# Altium schematic sheet Power.SchDoc: Наименование
size 420 x 297 mm; ApprovedBy: Утвердил; CheckedBy: Проверил; Author: Разработал; CompanyName: ВлГУ; DrawnBy: Н.Контр; Engineer: Т.Контр; SheetNumber: 3; SheetTotal: 1; PageSetup: Record=PageOptions|CenterHorizontal=True|CenterVertical=True|PrintScale=0.94|XCorrection=1.00|YCorrection=1.00|PrintKind=1|BorderSize=5000000|LeftOffset=0|BottomOffset=0|Orientation=1|PaperLength=1000|PaperWidth=1000|Scale=100|PaperSource=7|PrintQuality=-4|MediaType=1|DitherType=10|PaperKind=A4|PrintScaleMode=1; HeadOfSector: Нач. сектора; MainDevice: Перв.примен.; Name: Наименование; DocumentName: Sheet1.SCHDOC
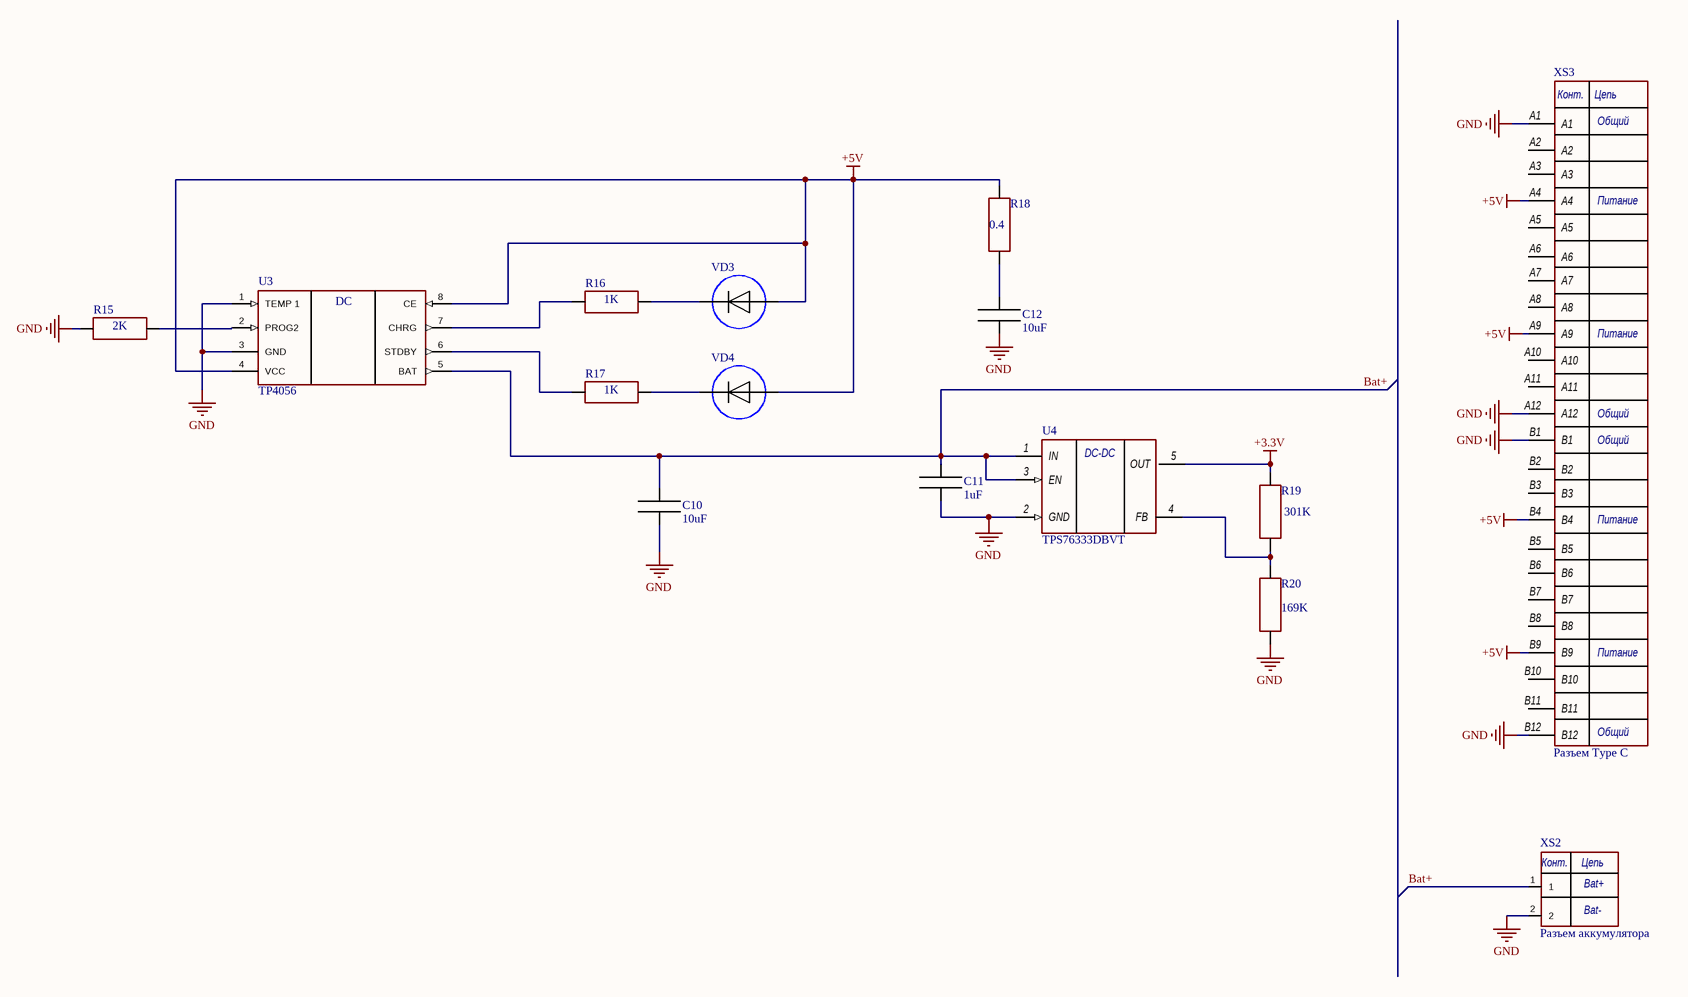
[diagram p0: Power.SchDoc]

## Parts
C10  10uF  [0402]
C11  1uF  [0402]
C12  10uF  [0402]
R15  2K  [0402]
R16  1K  [0402]
R17  1K  [0402]
R18  0.4  [0402]
R19  301K  [0402]
R20  169K  [0402]
U3  TP4056  [SOP-8]
U4  TPS76333DBVT  [SOT23-5]
VD3  Светодиод  [0402]  (value not drawn)
VD4  Светодиод  [0402]  (value not drawn)
XS2  Разъем аккумулятора  [PIN 2]
XS3  Разъем Type C  [USB Type C]

## Nets
+3.3V: R19.2 U4.5(OUT)
+5V: R18.2 U3.4(VCC) U3.8(CE) VD3.1 VD4.1 XS3.A4 XS3.A9 XS3.B4 XS3.B9
GND: C10.1 C11.1 C12.1 R15.1 R20.1 U3.1(TEMP_1) U3.3(GND) U4.2(GND) XS2.2 XS3.A1 XS3.A12 XS3.B1 XS3.B12
Bat+: C10.2 C11.2 U3.5(BAT) U4.1(IN) U4.3(EN) XS2.1
NetC12_2: C12.2 R18.1
NetR15_2: R15.2 U3.2(PROG2)
NetR16_1: R16.1 U3.7(CHRG)
NetR16_2: R16.2 VD3.2
NetR17_1: R17.1 U3.6(STDBY)
NetR17_2: R17.2 VD4.2
NetR19_1: R19.1 R20.2 U4.4(FB)

Not connected (* = marked no-connect by the designer): XS3 A2 A3 A5 A6 A7 A8 A10 A11 B2 B3 B5 B6 B7 B8 B10 B11

## Notes on the sheet
- (near XS3) Общий
- (near XS3) Питание
- (near XS2) Bat+
- (near XS2) Bat-
- Подп. и дата
- Инв.№ дубл.
- Взам.инв.№
- Подп.и дата
- Инв.№ подл.
- Изм.
- Лист
- № докум.
- Подп.
- Дата
- Формат  A3
- (in symbol TP4056) DC
- (in symbol TPS76333DBVT) DC-DC
- (in symbol Разъем 2) Конт.; Цепь
- (in symbol Разъем Type C) Конт.; Цепь

## Library data of the parts
C10-C12 = Конденсатор
R15-R20 = Резистор
XS2 = Разъем 2